# EAGLE design tes1 (EAGLE 6.6.0)
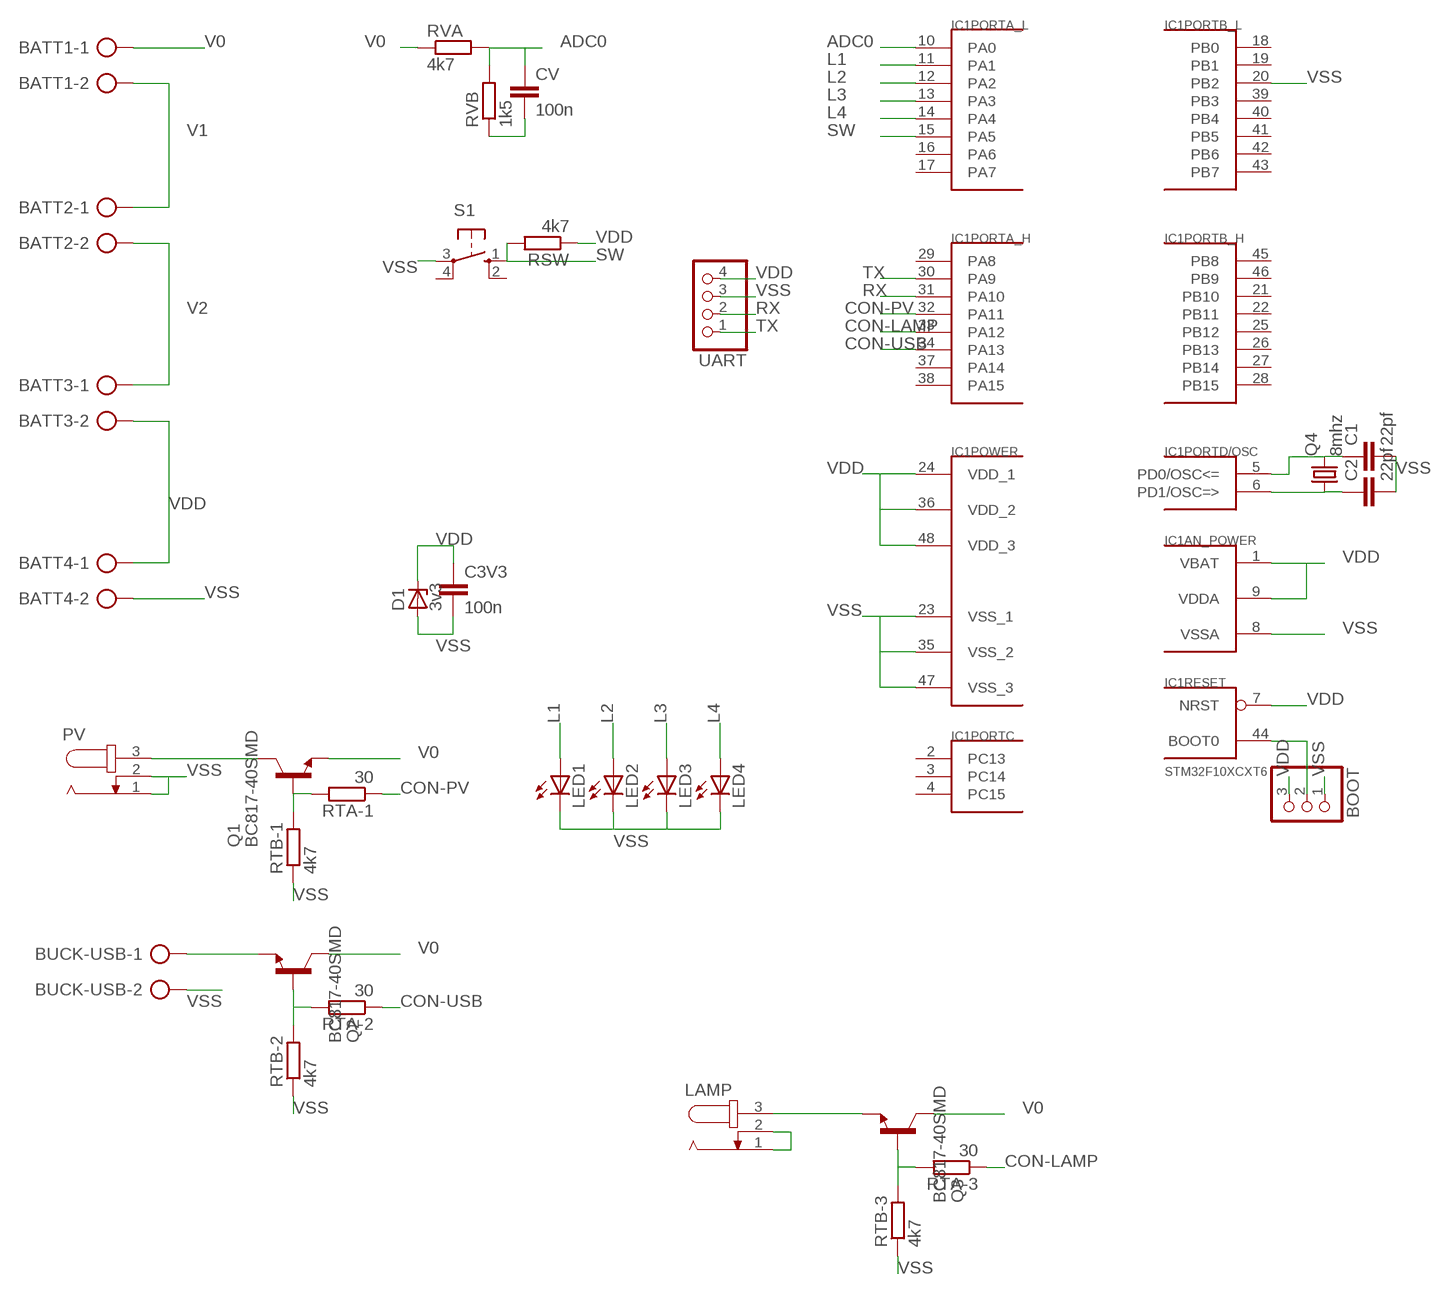
[diagram p0: schematic, sheet 1]

## Parts
BATT1  AK300/2  [AK300/2]
BATT2  AK300/2  [AK300/2]
BATT3  AK300/2  [AK300/2]
BATT4  AK300/2  [AK300/2]
BOOT  PINHD-1X3  [1X03]
BUCK-USB  AK300/2  [AK300/2]
C1  22pf  C-EUC0805  [C0805]
C2  22pf  C-EUC0805  [C0805]
C3V3  100n  C-EUC0805  [C0805]
CV  100n  C-EUC0805  [C0805]
D1  3v3  ZENER-DIODESMB  [SMB]
IC1  STM32F10XCXT6  [TQFP48]
LAMP  JACK-PLUG0  [SPC4077]
LED1  LEDCHIP-LED0805  [CHIP-LED0805]
LED2  LEDCHIP-LED0805  [CHIP-LED0805]
LED3  LEDCHIP-LED0805  [CHIP-LED0805]
LED4  LEDCHIP-LED0805  [CHIP-LED0805]
PV  JACK-PLUG0  [SPC4077]
Q1  BC817-40SMD  [SOT23-BEC]
Q2  BC817-40SMD  [SOT23-BEC]
Q3  BC817-40SMD  [SOT23-BEC]
Q4  8mhz  CRYSTALHC49U-V  [HC49U-V]
RSW  4k7  R-EU_R0805  [R0805]
RTA-1  30  R-EU_R0805  [R0805]
RTA-2  30  R-EU_R0805  [R0805]
RTA-3  30  R-EU_R0805  [R0805]
RTB-1  4k7  R-EU_R0805  [R0805]
RTB-2  4k7  R-EU_R0805  [R0805]
RTB-3  4k7  R-EU_R0805  [R0805]
RVA  4k7  R-EU_R0805  [R0805]
RVB  1k5  R-EU_R0805  [R0805]
S1  10-XX  [B3F-10XX]
UART  PINHD-1X4  [1X04]

## Nets
ADC0: CV.1 IC1.10(PORTA_L:PA0) RVA.2 RVB.2
CON-LAMP: IC1.33(PORTA_H:PA12) RTA-3.1
CON-PV: IC1.32(PORTA_H:PA11) RTA-1.1
CON-USB: IC1.34(PORTA_H:PA13) RTA-2.1
L1: IC1.11(PORTA_L:PA1) LED1.A
L2: IC1.12(PORTA_L:PA2) LED2.A
L3: IC1.13(PORTA_L:PA3) LED3.A
L4: IC1.14(PORTA_L:PA4) LED4.A
N$1: PV.3 Q1.C
N$2: LAMP.3 Q3.E
N$3: Q1.B RTA-1.2 RTB-1.2
N$4: Q3.B RTA-3.2 RTB-3.2
N$5: BOOT.2 IC1.44(RESET:BOOT0)
N$6: BUCK-USB.1 Q2.E
N$7: Q2.B RTA-2.2 RTB-2.2
N$10: C2.1 IC1.6(PORTD/OSC:PD1/OSC=>) Q4.1
N$11: C1.1 IC1.5(PORTD/OSC:PD0/OSC<=) Q4.2
RX: IC1.31(PORTA_H:PA10) UART.2
SW: IC1.15(PORTA_L:PA5) RSW.2 S1.1(S)
TX: IC1.30(PORTA_H:PA9) UART.1
V0: BATT1.1 Q1.E Q2.C Q3.C RVA.1
V1: BATT1.2 BATT2.1
V2: BATT2.2 BATT3.1
VDD: BATT3.2 BATT4.1 BOOT.3 C3V3.1 D1.C IC1.1(AN_POWER:VBAT) IC1.7(RESET:NRST) IC1.9(AN_POWER:VDDA) IC1.24(POWER:VDD_1) IC1.36(POWER:VDD_2) IC1.48(POWER:VDD_3) RSW.1 UART.4
VSS: BATT4.2 BOOT.1 BUCK-USB.2 C1.2 C2.2 C3V3.2 CV.2 D1.A IC1.8(AN_POWER:VSSA) IC1.20(PORTB_L:PB2) IC1.23(POWER:VSS_1) IC1.35(POWER:VSS_2) IC1.47(POWER:VSS_3) LAMP.1 LAMP.2 LED1.C LED2.C LED3.C LED4.C PV.1 PV.2 RTB-1.1 RTB-2.1 RTB-3.1 RVB.1 S1.3(P) UART.3
Unconnected: IC1.2(PORTC:PC13) IC1.3(PORTC:PC14) IC1.4(PORTC:PC15) IC1.16(PORTA_L:PA6) IC1.17(PORTA_L:PA7) IC1.18(PORTB_L:PB0) IC1.19(PORTB_L:PB1) IC1.21(PORTB_H:PB10) IC1.22(PORTB_H:PB11) IC1.25(PORTB_H:PB12) IC1.26(PORTB_H:PB13) IC1.27(PORTB_H:PB14) IC1.28(PORTB_H:PB15) IC1.29(PORTA_H:PA8) IC1.37(PORTA_H:PA14) IC1.38(PORTA_H:PA15) IC1.39(PORTB_L:PB3) IC1.40(PORTB_L:PB4) IC1.41(PORTB_L:PB5) IC1.42(PORTB_L:PB6) IC1.43(PORTB_L:PB7) IC1.45(PORTB_H:PB8) IC1.46(PORTB_H:PB9) S1.2(S1) S1.4(P1)

## Library data of the parts
BATT1-BATT4 BUCK-USB = con-ptr500:AK300/2: CONNECTOR; OC_FARNELL: unknown; OC_NEWARK: unknown
BOOT = pinhead:PINHD-1X3: PIN HEADER
C1 C2 C3V3 CV = resistor:C-EU: CAPACITOR, European symbol
D1 = diode:ZENER-DIODE: Z-Diode
IC1 = stm32:STM32F10XCXT6: ST STM32F101/103 48pin LQFP
LAMP PV = con-jack:JACK-PLUG: DC POWER JACK Power Jack, DC, Right Angle, Through Hole, Rated 5A at 16VDC, PC Terminals Distributor: Farnell (www.Farnell.de) Drawing: 84N1161.pdf / 84N1162.pdf Manufacturer: SPC Technology (www.spctechnology.com) Type: SPC4077 / SPC 4078; OC_FARNELL: unknown; OC_NEWARK: unknown
LED1-LED4 = led:LED: LED OSRAM: - CHIPLED LG R971, LG N971, LY N971, LG Q971, LY Q971, LO R971, LY R971 LH N974, LH R974 LS Q976, LO Q976, LY Q976 LO Q996 - Hyper CHIPLED LW Q18S LB Q993, LB Q99A, LB R99A - SideLED LS A670, LO A670, LY A670, LG A670, LP A670 LB A673, LV A673, LT A673, LW A673 LH A674 LY A675 LS A676, LA A676, LO A676, LY A676, LW A676 LS A679, LY A679, LG A679 - Hyper Micro SIDELED® LS Y876, LA Y876, LO Y876, LY Y876 LT Y87S - SmartLED LW L88C, LW L88S LB L89C, LB L89S, LG L890 LS L89K, LO L89K, LY L89K LS L896, LA L896, LO L896, LY L896 - TOPLED LS T670, LO T670, LY T670, LG T670, LP T670 LSG T670, LSP T670, LSY T670, LOP T670, LYG T670 LG T671, LOG T671, LSG T671 LB T673, LV T673, LT T673, LW T673 LH T674 LS T676, LA T676, LO T676, LY T676, LB T676, LH T676, LSB T676, LW T676 LB T67C, LV T67C, LT T67C, LS T67K, LO T67K, LY T67K, LW E67C LS E67B, LA E67B, LO E67B, LY E67B, LB E67C, LV E67C, LT E67C LW T67C LS T679, LY T679, LG T679 LS T770, LO T770, LY T770, LG T770, LP T770 LB T773, LV T773, LT T773, LW T773 LH T774 LS E675, LA E675, LY E675, LS T675 LS T776, LA T776, LO T776, LY T776, LB T776 LHGB T686 LT T68C, LB T68C - Hyper Mini TOPLED® LB M676 - Mini TOPLED Santana® LG M470 LS M47K, LO M47K, LY M47K Source: http://www.osram.convergy.de LUXEON: - LUMILED® LXK2-PW12-R00, LXK2-PW12-S00, LXK2-PW14-U00, LXK2-PW14-V00 LXK2-PM12-R00, LXK2-PM12-S00, LXK2-PM14-U00 LXK2-PE12-Q00, LXK2-PE12-R00, LXK2-PE12-S00, LXK2-PE14-T00, LXK2-PE14-U00 LXK2-PB12-K00, LXK2-PB12-L00, LXK2-PB12-M00, LXK2-PB14-N00, LXK2-PB14-P00, LXK2-PB14-Q00 LXK2-PR12-L00, LXK2-PR12-M00, LXK2-PR14-Q00, LXK2-PR14-R00 LXK2-PD12-Q00, LXK2-PD12-R00, LXK2-PD12-S00 LXK2-PH12-R00, LXK2-PH12-S00 LXK2-PL12-P00, LXK2-PL12-Q00, LXK2-PL12-R00 Source: www.luxeon.com KINGBRIGHT: KA-3528ASYC Source: www.kingbright.com
Q1-Q3 = transistor-npn:BC817*: NPN Transistor
Q4 = crystal:CRYSTAL: CRYSTAL; OC_FARNELL: 1666969; OC_NEWARK: unknown
RSW RTA-1-RTA-3 RTB-1-RTB-3 RVA RVB = resistor:R-EU_: RESISTOR, European symbol
S1 = switch-omron:10-XX: OMRON SWITCH; MPN: B3F-1000; OC_FARNELL: 176432; OC_NEWARK: 36M3542
UART = pinhead:PINHD-1X4: PIN HEADER

## Board
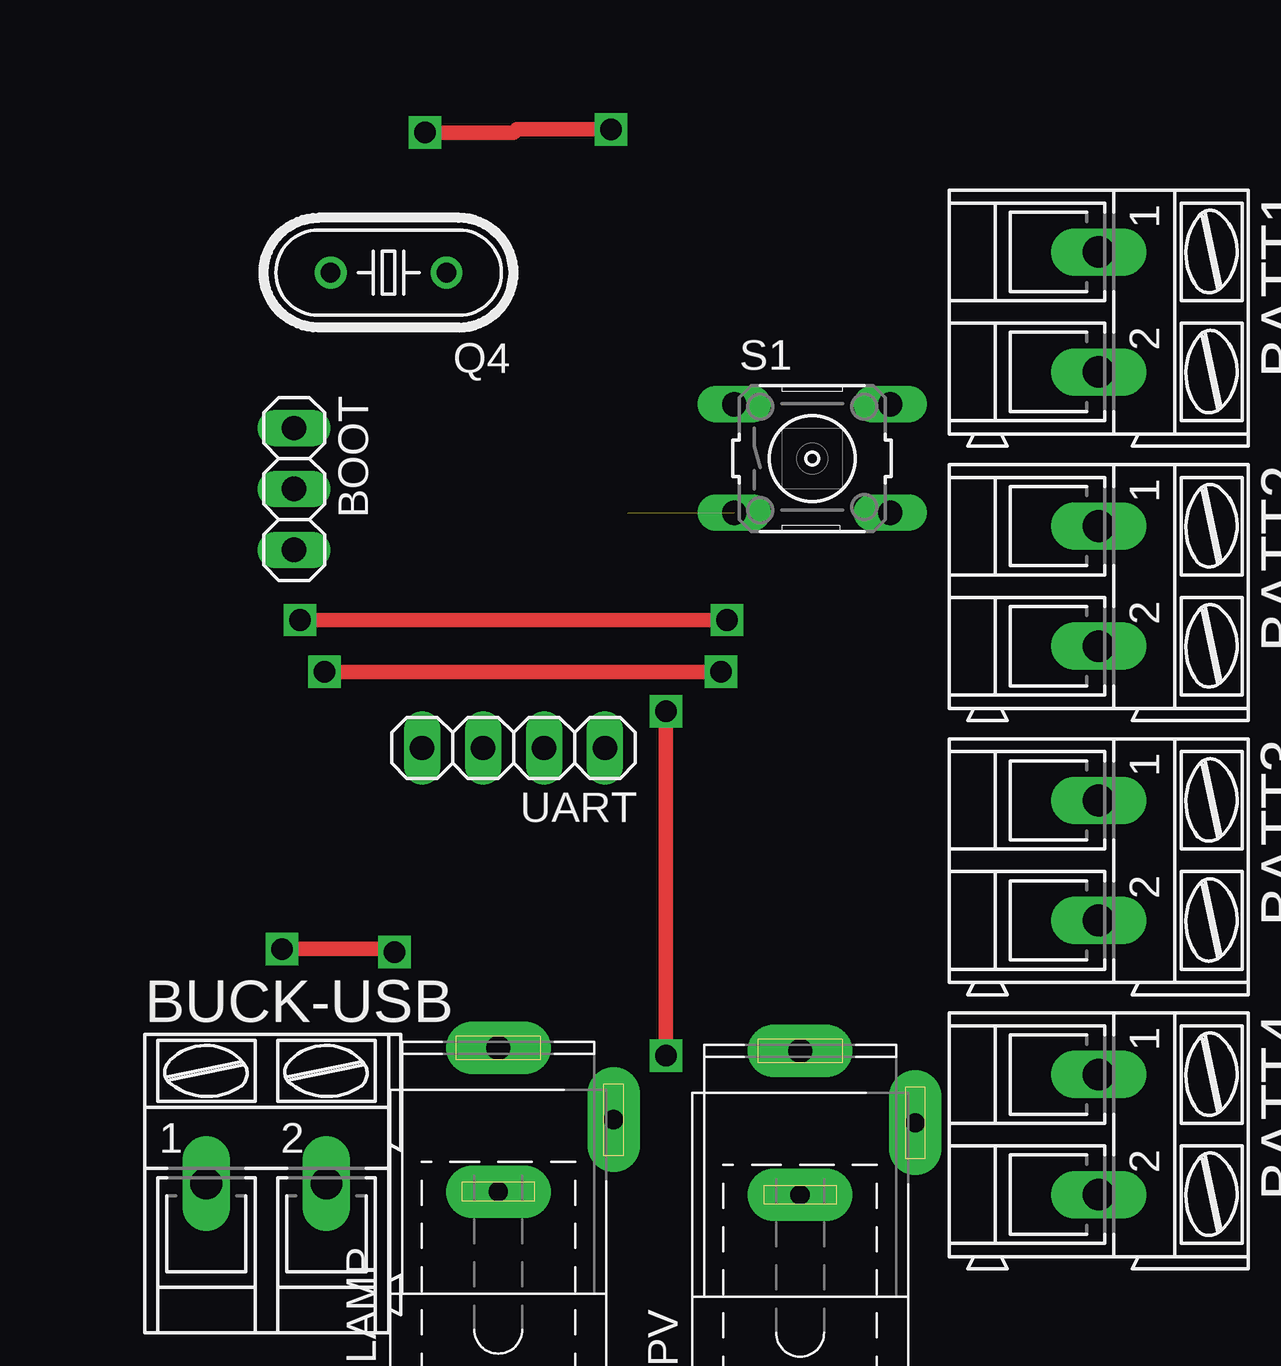
[diagram p1: board, top side]
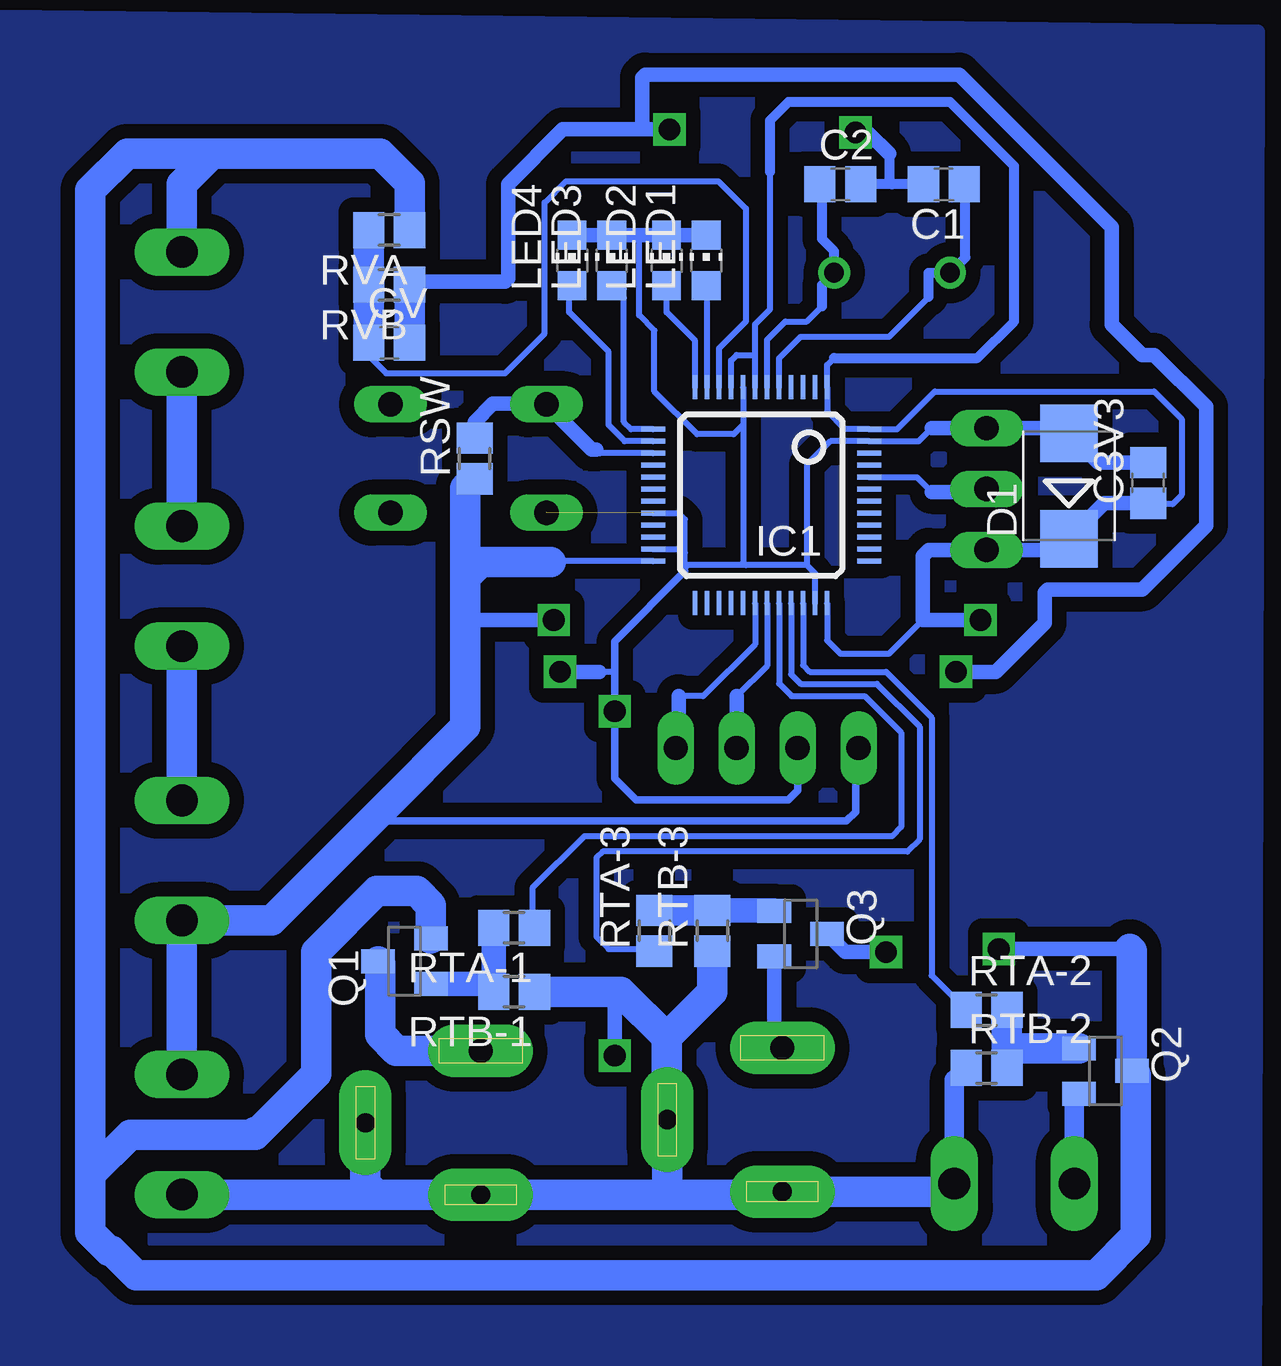
[diagram p2: board, bottom side, seen from below]

No outline drawn. Coordinates in mm, seen from the top.
Copper layers (1*16): Top 0.035mm / dielectric 1.5mm / Bottom 0.035mm
Design rules "default": minimum track width 10mil, minimum drill 24mil, track to track 8mil, track to pad 8mil, pad to pad 8mil, via to via 8mil, smd to smd 8mil, copper to edge 40mil, drill to drill 8mil, minimum pad ring 10mil, minimum via ring 8mil, stop-mask expansion 4mil, vias tented up to drill 0mil, thermal gap 10mil

### Footprints (pad centres in the part's own frame; a part is rotated, then mirrored left to right if it is on the bottom)
AK300/2 = drill 1.321 long: 1 -2.515,0; 2 2.489,0
1X03 = drill 1.016 long: 1 -2.54,0; 2 0,0; 3 2.54,0
C0805 = smd 1.3 x 1.5: 1 -0.85,0; 2 0.85,0
SMB = smd 2.4 x 2.4: A 2.2,0; C -2.2,0
TQFP48 = smd 0.2 x 1: 1 -2.75,-4.5; 2 -2.25,-4.5; 3 -1.75,-4.5; 4 -1.25,-4.5; 5 -0.75,-4.5; 6 -0.25,-4.5; 7 0.25,-4.5; 8 0.75,-4.5; 9 1.25,-4.5; 10 1.75,-4.5; 11 2.25,-4.5; 12 2.75,-4.5; 25 2.75,4.5; 26 2.25,4.5; 27 1.75,4.5; 28 1.25,4.5; 29 0.75,4.5; 30 0.25,4.5; 31 -0.25,4.5; 32 -0.75,4.5; 33 -1.25,4.5; 34 -1.75,4.5; 35 -2.25,4.5; 36 -2.75,4.5 | smd 1 x 0.2: 13 4.5,-2.75; 14 4.5,-2.25; 15 4.5,-1.75; 16 4.5,-1.25; 17 4.5,-0.75; 18 4.5,-0.25; 19 4.5,0.25; 20 4.5,0.75; 21 4.5,1.25; 22 4.5,1.75; 23 4.5,2.25; 24 4.5,2.75; 37 -4.5,2.75; 38 -4.5,2.25; 39 -4.5,1.75; 40 -4.5,1.25; 41 -4.5,0.75; 42 -4.5,0.25; 43 -4.5,-0.25; 44 -4.5,-0.75; 45 -4.5,-1.25; 46 -4.5,-1.75; 47 -4.5,-2.25; 48 -4.5,-2.75
SPC4077 = drill 0.8 pad 2.184 long: 1 -3,0; 2 0,-4.8 | drill 1 pad 2.184 long: 3 3,0
CHIP-LED0805 = smd 1.2 x 1.2: A 0,-1.05; C 0,1.05
SOT23-BEC = smd 1 x 1.4: B -0.95,-1.1; C 0,1.1; E 0.95,-1.1
HC49U-V = drill 0.813: 1 -2.413,0; 2 2.413,0
R0805 = smd 1.3 x 1.5: 1 -0.85,0; 2 0.85,0
B3F-10XX = drill 1.016 long: 1 -3.251,2.261; 2 3.251,2.261; 3 -3.251,-2.261; 4 3.251,-2.261
1X04 = drill 1.016 long: 1 -3.81,0; 2 -1.27,0; 3 1.27,0; 4 3.81,0

### Placement (x,y rotation side)
BATT1  60.33,67.06 270 top
BATT2  60.33,55.63 270 top
BATT3  60.33,44.2 270 top
BATT4  60.33,32.77 270 top
BOOT  26.8,59.69 270 top
BUCK-USB  25.65,30.73 0 top
C1  28.57,72.39 180 bottom
C2  32.89,72.39 0 bottom
C3V3  20.07,59.94 90 bottom
CV  51.69,65.79 0 bottom
D1  23.37,59.82 90 bottom
IC1  36.2,59.44 180 bottom
LAMP  35.31,33.4 90 top
LED1  38.48,69.22 0 bottom
LED2  40.13,69.22 0 bottom
LED3  42.42,69.22 0 bottom
LED4  44.07,69.22 0 bottom
PV  47.88,33.27 90 top
Q1  51.05,40.01 90 bottom
Q2  21.84,35.43 270 bottom
Q3  34.54,41.15 270 bottom
Q4  30.73,68.71 180 top
RSW  48.13,60.96 90 bottom
RTA-1  46.48,41.4 180 bottom
RTA-2  26.8,37.97 0 bottom
RTA-3  40.64,41.27 90 bottom
RTB-1  46.48,38.73 180 bottom
RTB-2  26.8,35.56 0 bottom
RTB-3  38.23,41.27 90 bottom
RVA  51.69,70.48 180 bottom
RVB  51.69,68.2 180 bottom
S1  48.39,60.96 0 top
UART  35.94,48.9 180 top

### Tracks (layer width: path | path; a pad name or v marks a point on that pad's centre or on a via)
ADC0
  Bottom 0.254: CV.1 52.54,65.24 51.82,64.52 46.86,64.52 45.21,66.17 45.21,71.63 44.32,72.52 37.97,72.52 36.83,71.37 36.83,66.67 37.95,65.56 IC1.10
  Bottom 1.27: RVA.2 RVB.2 CV.1
CON-LAMP
  Bottom 0.254: IC1.33 34.95,51.96 34.54,51.56 31.37,51.56 29.59,49.78 29.59,45.09 30.1,44.58 42.8,44.58 43.05,44.32 43.05,41.02 42.55,40.51 40.73,40.51 RTA-3.1
CON-PV
  Bottom 0.254: IC1.32 35.45,51.57 34.92,51.05 31.88,51.05 30.35,49.53 30.35,45.59 30.73,45.21 43.56,45.21 45.72,43.05 45.72,41.49 RTA-1.1
CON-USB
  Bottom 0.254: IC1.34 34.45,52.35 34.16,52.07 30.99,52.07 29.08,50.16 29.08,39.41 RTA-2.1
L1
  Bottom 0.254: IC1.11 38.45,68.13 LED1.A
L2
  Bottom 0.254: IC1.12 38.95,65.87 40.13,67.06 LED2.A
L3
  Bottom 0.254: IC1.13 41.61,62.19 41.91,62.48 41.91,67.66 LED3.A 41.91,68.04
L4
  Bottom 0.254: IC1.14 41.87,61.69 42.55,62.36 42.55,65.41 44.2,67.06 44.2,68.04 LED4.A
N$1
  Bottom 1.27: PV.3 51.39,36.27 52.07,36.96 52.07,39.92 Q1.C
N$2
  Bottom 0.61: Q3.E 35.64,36.74 LAMP.3
N$3
  Bottom 1.016: Q1.B 47.65,39.05 RTB-1.2 RTA-1.2
N$4
  Bottom 1.016: RTB-3.2 35.67,42.12 Q3.B
  Bottom 1.27: RTA-3.2 RTB-3.2
N$5
  Bottom 0.254: IC1.44 29.71,60.19 29.08,59.56
  Bottom 0.61: 29.08,59.56 26.92,59.56 BOOT.2
N$6
  Bottom 0.813: BUCK-USB.1 23.14,34.29 Q2.E
N$7
  Bottom 1.27: RTB-2.2 25.95,36.45 | 25.95,36.45 RTA-2.2 | Q2.B 25.88,36.38 25.95,36.45
N$9
  pour Bottom (isolate 0.61): 15.49,78.74 67.94,79.38 68.45,20.83 15.62,20.83
N$10
  Bottom 0.254: IC1.6 35.95,65.91 35.18,66.67 34.29,66.67 33.66,67.31
  Bottom 0.406: C2.1 33.66,72.3 33.66,70.1 33.15,69.6 Q4.1 33.66,68.2 33.66,67.31
N$11
  Bottom 0.254: IC1.5 35.45,65.14 34.54,66.04 30.86,66.04 29.21,67.69
  Bottom 0.406: 29.21,67.69 29.21,68.71 Q4.2 27.69,69.34 27.69,72.35 C1.1
RX
  Bottom 0.254: IC1.31 35.95,52.32 37.21,51.05
  Bottom 0.61: 37.21,51.05 UART.2
SW
  Bottom 0.254: IC1.15 42.9,61.19 43.05,61.34
  Bottom 0.61: 43.05,61.34 43.26,61.34 S1.1 45.16,63.25 47.37,63.25 48.13,62.48 RSW.2
TX
  Bottom 0.254: IC1.30 36.45,53.22 38.61,51.05 39.62,51.05
  Bottom 0.61: 39.62,51.05 39.62,49.02 UART.1
V0  (via drill 0.9)
  Top 0.61: v26.29,40.51 30.86,40.51 v30.99,40.39
  Bottom 0.61: 20.83,40.51 v26.29,40.51 | v30.99,40.39 32.68,40.39 Q3.C
  Bottom 1.27: 59.05,73.66 52.07,73.66 50.84,72.43 RVA.1 | 59.05,73.66 60.33,72.39 BATT1.1 | Q1.E 49.95,42.33 50.55,42.93 52.2,42.93 54.74,40.39 54.74,35.31 57.15,32.89 | 57.15,32.89 57.28,32.77 57.4,32.77 | 64.14,31.11 64.14,28.7 63.37,27.94 63.25,27.94 62.23,26.92 22.23,26.92 20.57,28.57 20.57,35.26 Q2.C 20.74,40.43 20.83,40.51 | 59.05,73.66 62.61,73.66 64.14,72.14 64.14,31.11 | 57.15,32.89 57.28,32.89 57.4,32.77 | 57.4,32.77 62.48,32.77 64.14,31.11
V1
  Bottom 1.27: BATT1.2 BATT2.1
V2
  Bottom 1.27: BATT2.2 BATT3.1
VDD  (via drill 0.9)
  Top 0.61: v27.05,54.23 v44.83,54.23
  Bottom 0.254: IC1.24 44.91,56.69 44.96,56.64 | IC1.36 33.45,53.38 32.89,52.83 30.86,52.83 29.46,54.23 | C3V3.1 20.03,59.05 19.05,59.05 18.67,59.44 18.67,62.61 19.81,63.75 28.96,63.75 30.52,62.19 IC1.48 32.72,62.19 33.45,62.91 IC1.1 33.45,64.85 33.15,65.15 | IC1.9 37.45,65.04 37.21,65.28 36.45,65.28 | IC1.7 36.45,65.28 | 36.45,65.28 36.45,66.55 35.81,67.18 35.81,72.9
  Bottom 0.305: UART.4 32.13,48.26 32.26,48.13 32.26,46.23 32.64,45.85 51.69,45.85 52.07,46.23
  Bottom 0.406: 33.15,65.15 27.18,65.15 25.65,66.67 25.65,73.15 28.32,75.82 35.05,75.82 35.81,75.06 35.81,72.9
  Bottom 0.61: C3V3.1 21.89,59.09 D1.C 23.84,57.15 BOOT.3 29.21,57.15 29.46,56.9 29.46,54.23 v27.05,54.23 | 51.94,46.35 52.07,46.23 | v44.83,54.23 48.51,54.23
  Bottom 1.27: BATT4.1 BATT3.2 56.59,41.71 52.07,46.23 48.51,49.78 48.51,54.23 48.51,56.01 | 48.51,56.01 48.51,59.73 RSW.1 | 44.96,56.64 47.88,56.64 48.51,56.01
VSS  (via drill 0.9)  (1 unrouted)
  Top 0.61: v44.58,52.07 v28.07,52.07 | v42.29,50.42 v42.29,36.07 | v40.01,74.68 36.07,74.68 35.94,74.55 v32.26,74.55
  Bottom 0: 42.16,47.5 42.16,50.42 42.29,50.55
  Bottom 0.254: 29.08,62.23 29.63,61.69 IC1.47 33.31,61.69 34.29,60.71 34.29,56.52 | IC1.23 39.53,57.19 39.37,57.02 | 39.37,56.26 39.37,56.39 | 39.37,56.39 39.37,57.02 | IC1.20 39.64,58.69 39.37,58.42 39.37,57.02 | IC1.35 33.95,56.17 34.29,56.52 | 34.29,56.52 36.83,56.52 | 36.83,56.52 39.24,56.52 39.37,56.39 | 36.83,56.52 36.95,56.63 IC1.8 36.95,62.37 37.34,61.98 38.86,61.98 40.64,63.75 40.64,66.29 41.27,66.93 41.27,70.01 41.53,70.27 | 42.29,52.07 42.93,52.07
  Bottom 0.305: UART.3 34.67,47.12 35.05,46.74 41.4,46.74 42.16,47.5 42.29,47.62 v42.29,50.42 | 42.29,50.55 42.29,52.07 42.29,53.34 39.37,56.26
  Bottom 0.406: C1.2 30.73,72.39 | 30.73,72.39 C2.2 | 30.86,73.66 30.86,72.52 30.73,72.39
  Bottom 0.61: C3V3.2 22.14,60.79 D1.A 23.58,62.23 BOOT.1 29.08,62.23 | LED1.C LED2.C 41.53,70.27 LED3.C LED4.C | 42.93,52.07 v44.58,52.07 | v28.07,52.07 26.42,52.07 24.38,54.1 24.38,55.37 24.26,55.5 20.32,55.5 17.65,58.17 17.65,63.12 19.81,65.28 20.32,65.28 21.59,66.55 21.59,70.61 27.94,76.96 41.02,76.96 41.15,76.83 41.15,74.68 | RVB.1 50.71,68.33 46.86,68.33 46.74,68.45 46.74,72.39 44.45,74.68 41.15,74.68 | 42.29,50.55 v42.29,50.42 | v42.29,36.07 42.29,38.23 42.8,38.73 | 30.86,73.66 31.75,74.55 v32.26,74.55 | 41.15,74.68 v40.01,74.68
  Bottom 0.813: BUCK-USB.2 28.14,35.06 RTB-2.1
  Bottom 1.27: 39.88,30.27 PV.1 52.2,30.28 | 39.88,30.27 35.86,30.27 35.81,30.23 35.48,30.23 LAMP.1 28.48,30.4 BUCK-USB.2 | 39.88,30.27 40.11,30.5 LAMP.2 40.13,33.43 40.13,36.83 | RTB-3.1 38.23,38.73 40.13,36.83 | CV.2 RVB.1 | BATT4.2 52.2,30.28 | PV.2 52.68,30.76 52.2,30.28 | RTB-1.1 42.8,38.73 42.04,38.73 40.13,36.83